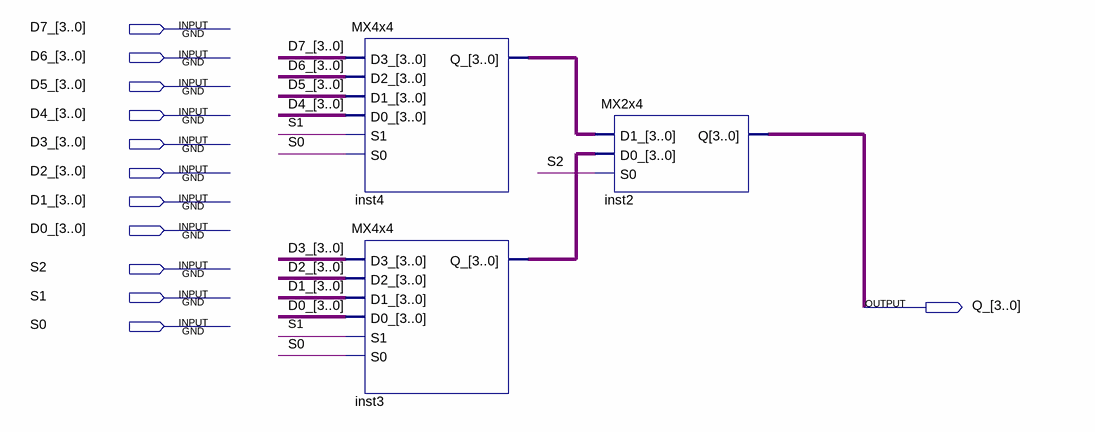
[diagram p0: schematic sheet]
// Quartus schematic MX8x4.bdf as structural Verilog: 3 symbols, 12 pins
module MX8x4 (
  input  [3:0] D7_,
  input  [3:0] D6_,
  input  [3:0] D5_,
  input  [3:0] D4_,
  input  [3:0] D3_,
  input  [3:0] D2_,
  input  [3:0] D1_,
  input  [3:0] D0_,
  input  S2,
  input  S1,
  input  S0,
  output [3:0] Q_
);

  wire [3:0] inst3_q_, inst4_q_;

  MX4x4 inst4 (.D3_(D7_), .D2_(D6_), .D1_(D5_), .D0_(D4_), .S1(S1), .S0(S0), .Q_(inst4_q_));
  MX4x4 inst3 (.D3_(D3_), .D2_(D2_), .D1_(D1_), .D0_(D0_), .S1(S1), .S0(S0), .Q_(inst3_q_));
  MX2x4 inst2 (.D1_(inst4_q_), .D0_(inst3_q_), .S0(S2), .Q(Q_));
endmodule
